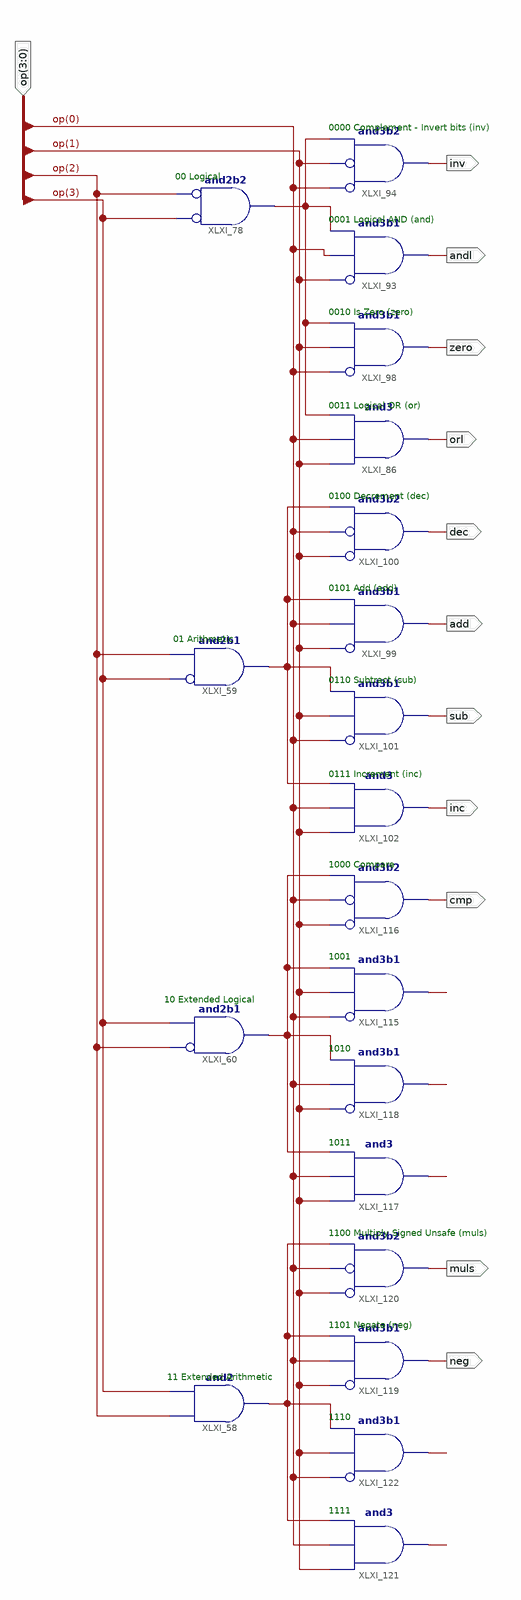
[diagram p0: schematic sheet 1]
// Xilinx ISE schematic alu_decoder.sch (spartan3e) as structural Verilog: 20 symbols, 12 ports
module alu_decoder (
  input  [3:0] op,
  output inv,
  output andl,
  output zero,
  output orl,
  output dec,
  output add,
  output sub,
  output inc,
  output cmp,
  output muls,
  output neg
);

  wire XLXN_63, XLXN_67, XLXN_80, XLXN_81, XLXN_82, XLXN_86, XLXN_87, XLXN_88, XLXN_91;

  and XLXI_78 (XLXN_63, ~op[3], ~op[2]);  // and2b2
  and XLXI_93 (andl, ~op[1], op[0], XLXN_63);  // and3b1
  and XLXI_94 (inv, ~op[0], ~op[1], XLXN_63);  // and3b2
  and XLXI_86 (orl, op[1], op[0], XLXN_63);
  and XLXI_98 (zero, ~op[0], op[1], XLXN_63);  // and3b1
  and XLXI_100 (dec, ~op[1], ~op[0], XLXN_67);  // and3b2
  and XLXI_101 (sub, ~op[0], op[1], XLXN_67);  // and3b1
  and XLXI_102 (inc, op[1], op[0], XLXN_67);
  and XLXI_60 (XLXN_88, ~op[2], op[3]);  // and2b1
  and XLXI_59 (XLXN_67, ~op[3], op[2]);  // and2b1
  and XLXI_115 (XLXN_80, ~op[0], op[1], XLXN_88);  // and3b1
  and XLXI_116 (cmp, ~op[1], ~op[0], XLXN_88);  // and3b2
  and XLXI_117 (XLXN_82, op[1], op[0], XLXN_88);
  and XLXI_118 (XLXN_81, ~op[1], op[0], XLXN_88);  // and3b1
  and XLXI_119 (neg, ~op[1], op[0], XLXN_91);  // and3b1
  and XLXI_120 (muls, ~op[1], ~op[0], XLXN_91);  // and3b2
  and XLXI_121 (XLXN_87, op[1], op[0], XLXN_91);
  and XLXI_122 (XLXN_86, ~op[0], op[1], XLXN_91);  // and3b1
  and XLXI_58 (XLXN_91, op[2], op[3]);
  and XLXI_99 (add, ~op[1], op[0], XLXN_67);  // and3b1

  // Notes on the sheet:
  //   0000 Complement - Invert bits (inv)
  //   00 Logical
  //   0001 Logical AND (and)
  //   0010 Is Zero (zero)
  //   0011 Logical OR (or)
  //   0100 Decrement (dec)
  //   0101 Add (add)
  //   01 Arithmetic
  //   0110 Subtract (sub)
  //   0111 Increment (inc)
  //   1000 Compare
  //   1001
  //   10 Extended Logical
  //   1010
  //   1011
  //   1100 Multiply Signed Unsafe (muls)
  //   1101 Negate (neg)
  //   11 Extended Arithmetic
  //   1110
  //   1111
endmodule
